# EAGLE design remotecontrol (EAGLE 4.16)
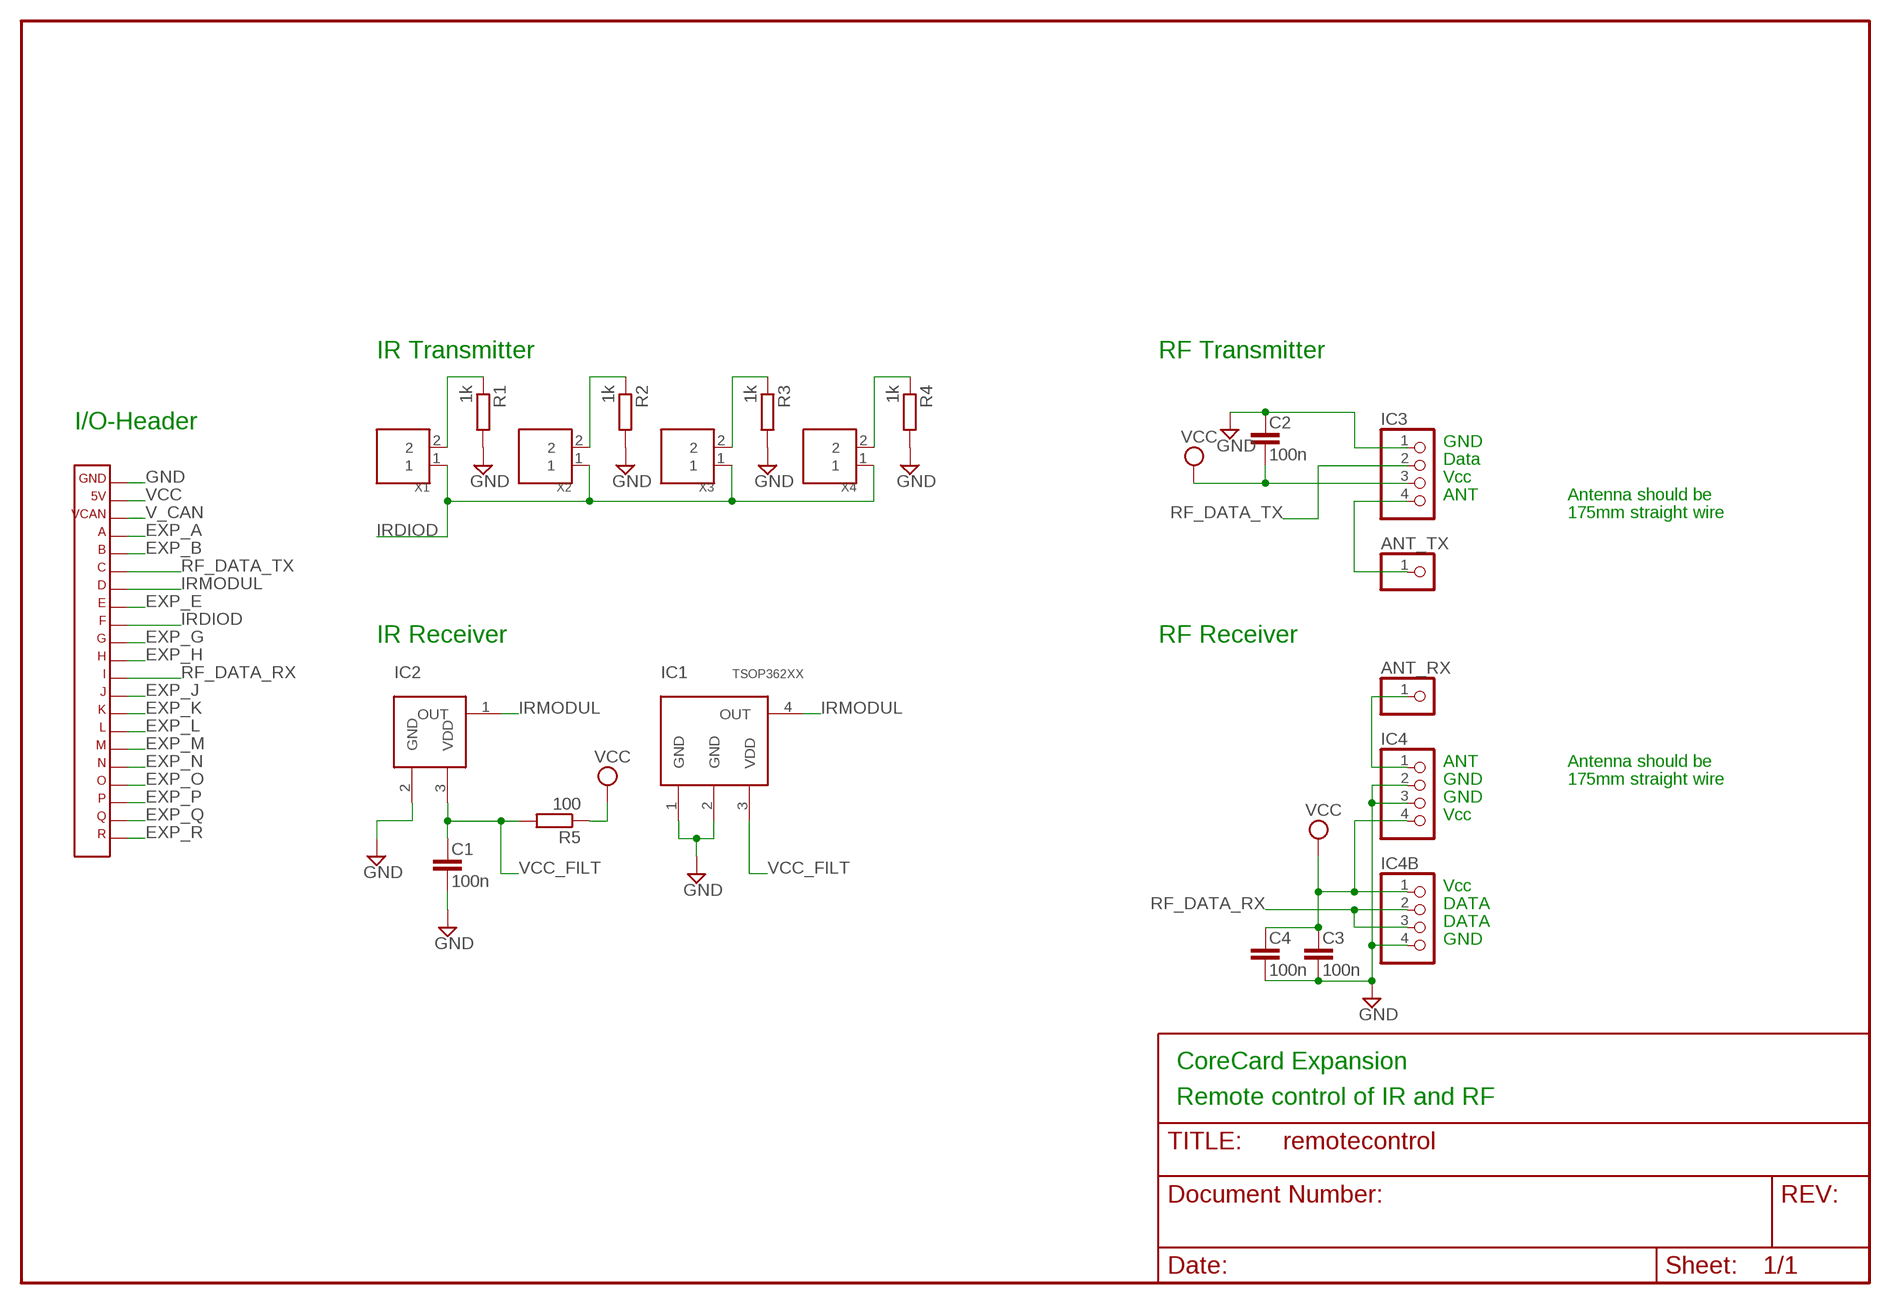
[diagram p0: schematic, sheet 1]

## Parts
ANT_RX  PINHD-1X1  [1X01]
ANT_TX  PINHD-1X1  [1X01]
C1  100n  C-EU  [C0603]
C2  100n  C-EU  [C0603]
C3  100n  C-EU  [C0603]
C4  100n  C-EU  [C0603]
IC1  TSOP362XX  [SMD]
IC2  ELIRM8601S  [STD]
IC3  PINHD-1X4  [1X04]
IC4  PINHD-1X4  [1X04]
IC4B  PINHD-1X4  [1X04]
R1  1k  R-EU_R0603  [R0603@1]
R2  1k  R-EU_R0603  [R0603@1]
R3  1k  R-EU_R0603  [R0603@1]
R4  1k  R-EU_R0603  [R0603@1]
R5  100  R-EU_R0603  [R0603@1]
X1  BLOCK22.54  [PCB2]
X2  BLOCK22.54  [PCB2]
X3  BLOCK22.54  [PCB2]
X4  BLOCK22.54  [PCB2]
X5  CORE_IOHEADEXP  [CORE_IOHEAD_NOSILC]

## Nets
ANT: ANT_TX.1 IC3.4
EXP_A: X5.4
EXP_B: X5.5
EXP_E: X5.8
EXP_G: X5.10
EXP_H: X5.11
EXP_J: X5.13
EXP_K: X5.14
EXP_L: X5.15
EXP_M: X5.16
EXP_N: X5.17
EXP_O: X5.18
EXP_P: X5.19
EXP_Q: X5.20
EXP_R: X5.21
GND: C1.2 C2.1 C3.2 C4.2 IC1.1(GND) IC1.2(GND) IC2.2(GND) IC3.1 IC4.2 IC4.3 IC4B.4 R1.2 R2.2 R3.2 R4.2 X5.1
IRDIOD: X1.1 X2.1 X3.1 X4.1 X5.9
IRMODUL: IC1.4(OUT) IC2.1(OUT) X5.7
N$1: R4.1 X4.2
N$2: R3.1 X3.2
N$3: R1.1 X1.2
N$4: R2.1 X2.2
N$5: ANT_RX.1 IC4.1
RF_DATA_RX: IC4B.2 IC4B.3 X5.12
RF_DATA_TX: IC3.2 X5.6
V_CAN: X5.3
VCC: C2.2 C3.1 C4.1 IC3.3 IC4.4 IC4B.1 R5.1 X5.2
VCC_FILT: C1.1 IC1.3(VDD) IC2.3(VDD) R5.2

## Notes on the sheet
- IR Transmitter | RF Transmitter
- I/O-Header
- GND
- Data
- Vcc
- ANT | Antenna should be
- 175mm straight wire
- IR Receiver | RF Receiver
- ANT | Antenna should be
- GND | 175mm straight wire
- GND
- Vcc
- Vcc
- DATA
- DATA
- GND
- CoreCard Expansion
- Remote control of IR and RF

## Library data of the parts
ANT_RX ANT_TX = pinhead-mm:PINHD-1X1
C1-C4 = rcl:C-EU
IC1 = tsop362xx:TSOP362XX
IC2 = elirm8601s:ELIRM8601S
IC3 IC4 IC4B = pinhead-mm:PINHD-1X4
R1-R5 = rcl:R-EU_: RESISTOR, European symbol
X1-X4 = terminal_block:BLOCK2
X5 = expboard:CORE_IOHEAD: CoreCard IO-header for expansion cards

## Board
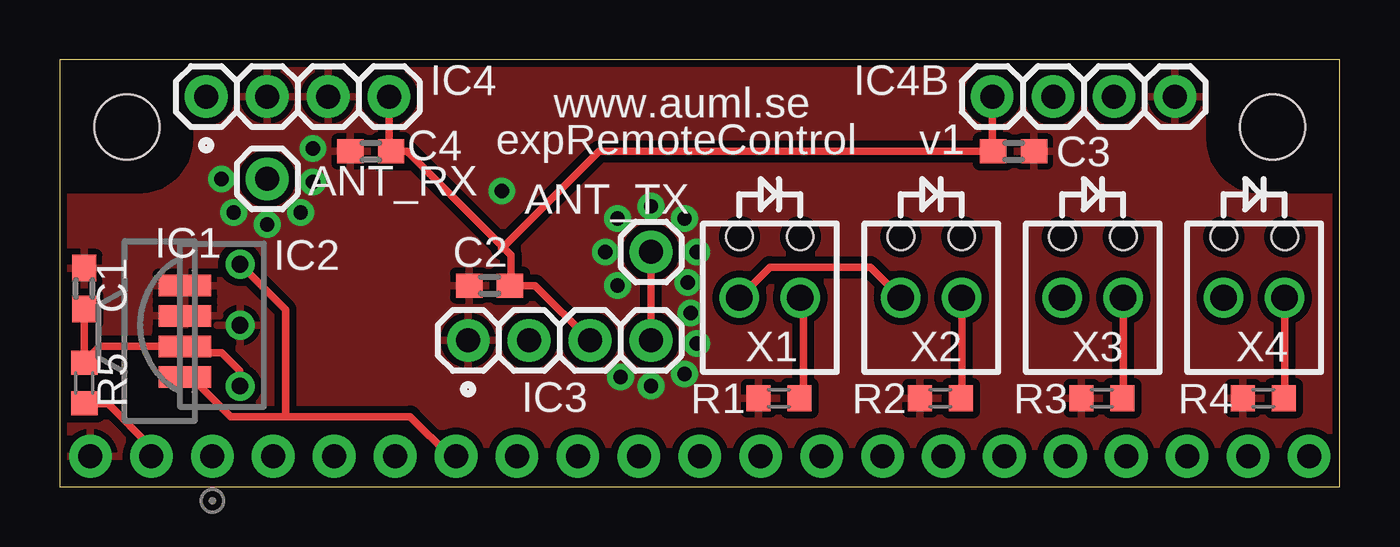
[diagram p1: board, top side]
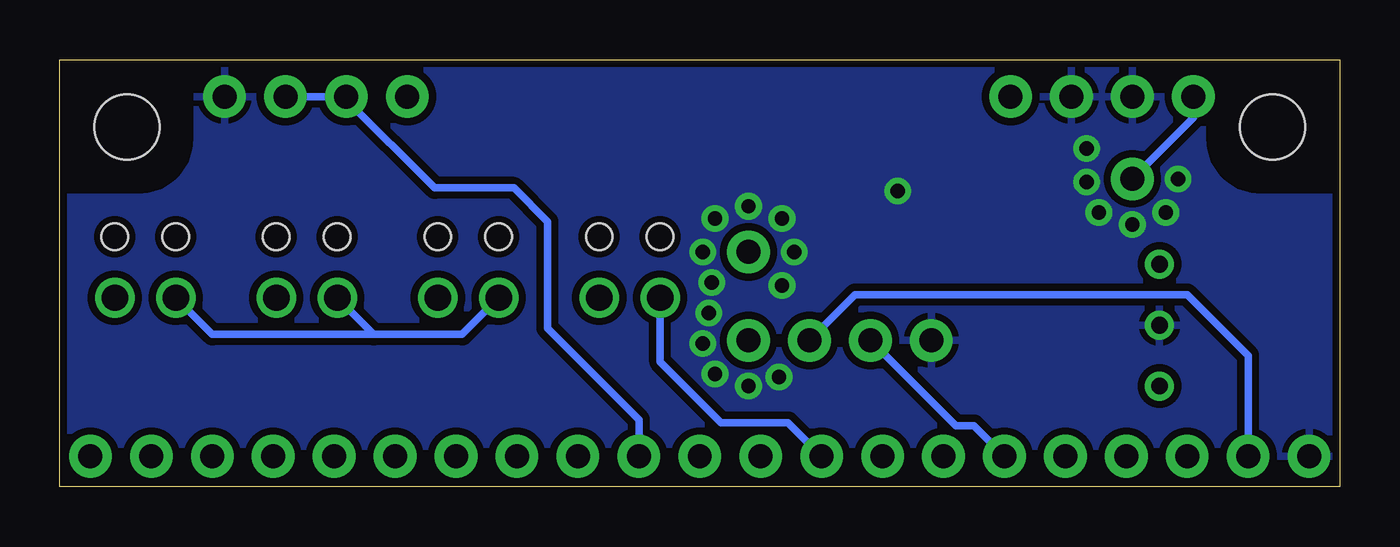
[diagram p2: board, bottom side, seen from below]

Size 53.34 x 17.78 mm. Coordinates in mm from the lower left corner, seen from the top.
Outline: 0,0 53.34,0 53.34,17.78 0,17.78 0,0
Copper layers (1*16): Top 0.035mm / dielectric 1.5mm / Bottom 0.035mm
Design rules "default": minimum track width 10mil, minimum drill 0.6mm, track to track 10mil, track to pad 10mil, pad to pad 10mil, via to via 10mil, smd to smd 8mil, copper to edge 10mil, drill to drill 8mil, minimum pad ring 10mil, minimum via ring 10mil, stop-mask expansion 4mil, vias tented up to drill 0mil, thermal gap 10mil
Holes 2.7 mm at 50.55,14.99 2.79,14.99

### Footprints (pad centres in the part's own frame; a part is rotated, then mirrored left to right if it is on the bottom)
1X01 = drill 1 pad 1.778 round: 1 0,0
C0603 = smd 1.1 x 1: 1 -0.85,0; 2 0.85,0
SMD = smd 0.9 x 2.2: 1 -1.905,0; 2 -0.635,0; 3 0.635,0; 4 1.905,0
STD = drill 0.7 round: 1 2.54,-0.9; 2 0,-0.9; 3 -2.54,-0.9
1X04 = drill 1 pad 1.778 round: 1 -3.81,0; 2 -1.27,0; 3 1.27,0; 4 3.81,0
R0603@1 = smd 1 x 1.1: 1 -0.85,0; 2 0.85,0
PCB2 = drill 1.1 round: 1 -2.54,0; 2 0,0 | hole 1.1: -2.54,2.54; 0,2.54
CORE_IOHEAD_NOSILC = drill 1 pad 1.778 round: 1 25.4,0; 2 22.86,0; 3 20.32,0; 4 17.78,0; 5 15.24,0; 6 12.7,0; 7 10.16,0; 8 7.62,0; 9 5.08,0; 10 2.54,0; 11 0,0; 12 -2.54,0; 13 -5.08,0; 14 -7.62,0; 15 -10.16,0; 16 -12.7,0; 17 -15.24,0; 18 -17.78,0; 19 -20.32,0; 20 -22.86,0; 21 -25.4,0

### Placement (x,y rotation side)
ANT_RX  8.64,12.83 0 top
ANT_TX  24.64,9.78 0 top
C1  1.02,8.26 90 top
C2  17.91,8.38 0 top
C3  39.75,13.97 0 top
C4  12.95,13.97 180 top
IC1  5.21,6.48 270 top
IC2  6.6,6.73 90 top
IC3  20.83,6.1 0 top
IC4  9.91,16.26 0 top
IC4B  42.67,16.26 0 top
R1  29.97,3.68 180 top
R2  36.7,3.68 180 top
R3  43.43,3.68 180 top
R4  50.16,3.68 180 top
R5  1.02,4.32 90 top
X1  30.86,7.87 0 top
X2  37.59,7.87 0 top
X3  44.32,7.87 0 top
X4  51.05,7.87 0 top
X5  26.67,1.27 0 bottom

### Tracks (layer width: path | path; a pad name or v marks a point on that pad's centre or on a via)
ANT
  Top 0.305: IC3.4 ANT_TX.1
GND  (via drill 0.6)
  other vias: 6.73,12.83 7.24,11.43 8.64,10.92 10.03,11.43 10.54,12.7 10.54,14.1 23.24,8.38 26.16,8.51 22.73,9.78 23.24,11.18 24.64,11.68 26.04,11.18 26.54,9.78 23.37,4.57 24.64,4.19 26.04,4.7 26.54,5.97 26.29,7.24 18.41,12.32
  pour Bottom (isolate 0.305, rank 3): 5.71,17.78 47.62,17.78 47.62,14.48 arc90 50.04,12.06 53.34,12.06 53.34,1.14 0,1.14 0,12.06 3.3,12.06 arc90 5.71,14.48
  pour Top (isolate 0.305, rank 3): 5.71,17.78 47.62,17.78 47.62,14.48 arc90 50.04,12.06 53.34,12.06 53.34,1.14 0,1.14 0,12.06 3.3,12.06 arc90 5.71,14.48
IRDIOD
  Top 0.305: X2.1 33.78,9.14 29.59,9.14 X1.1
  Bottom 0.305: X5.9 22.99,2.67 25.78,2.67 28.32,5.21 X1.1 | X4.1 46.99,6.35 40.26,6.35 | 40.26,6.35 36.58,6.35 X2.1 | 40.26,6.35 X3.1
IRMODUL
  Top 0.305: IC1.4 5.46,4.83 5.21,4.83 7.11,2.92 9.4,2.92 | 9.4,2.92 14.61,2.92 16.26,1.27 X5.7 | IC2.1 9.4,7.38 9.4,2.92
N$1
  Top 0.305: R4.1 51.05,3.94 X4.2
N$2
  Top 0.305: R3.1 44.32,4.06 X3.2
N$3
  Top 0.305: R1.1 30.82,3.77 30.99,3.94 30.99,7.75 X1.2
N$4
  Top 0.305: R2.1 37.59,3.94 X2.2
N$5
  Bottom 0.305: ANT_RX.1 6.1,15.37 IC4.1
RF_DATA_RX
  Bottom 0.305: X5.12 29.21,2.79 33.02,6.6 33.02,11.05 34.42,12.45 37.72,12.45 41.4,16.13 IC4B.2 IC4B.3
RF_DATA_TX
  Bottom 0.305: X5.6 15.24,2.54 16,2.54 IC3.2
VCC
  Top 0.305: R5.1 2.03,3.43 3.81,1.65 X5.2 | 18.8,8.38 19.81,8.38 IC3.3 | 13.72,13.97 C4.1 | 13.72,13.97 IC4.4 | 38.86,13.97 C3.1 | 38.86,13.97 IC4B.1 | 13.72,13.97 14.48,13.97 18.48,9.97 | 18.48,9.97 18.8,9.65 18.8,8.38 | 18.8,8.38 C2.2 | 18.48,9.97 18.41,9.91 | 38.86,13.97 22.48,13.97 18.48,9.97
  Bottom 0.305: IC3.3 20.19,8 6.35,8 3.81,5.46 X5.2 3.81,1.14
VCC_FILT
  Top 0.305: 1.14,5.33 1.02,5.21 R5.2 1.18,5.21 1.14,5.33 | 1.14,5.33 1.65,5.84 IC1.3 5.59,5.71 5.71,5.59 6.73,5.59 7.49,4.83 IC2.3 | 1.14,5.33 1.02,5.33 C1.1

### Text on the board
tPlace: www.auml.se | expRemoteControl | v1
Document: Top is component side | Expansion will be mounted bottom to bottom with CoreCard | Change vertical dimension to fit | Remove I/O-header silcscreen if neccesary | Remove mounting holes if neccesary
tDocu: - | + | A | B | C | D | E | F | G | H | I | J | K | L | M | N | O | P | Q | R